# EAGLE design sx-signal84 (EAGLE 7.4.0)
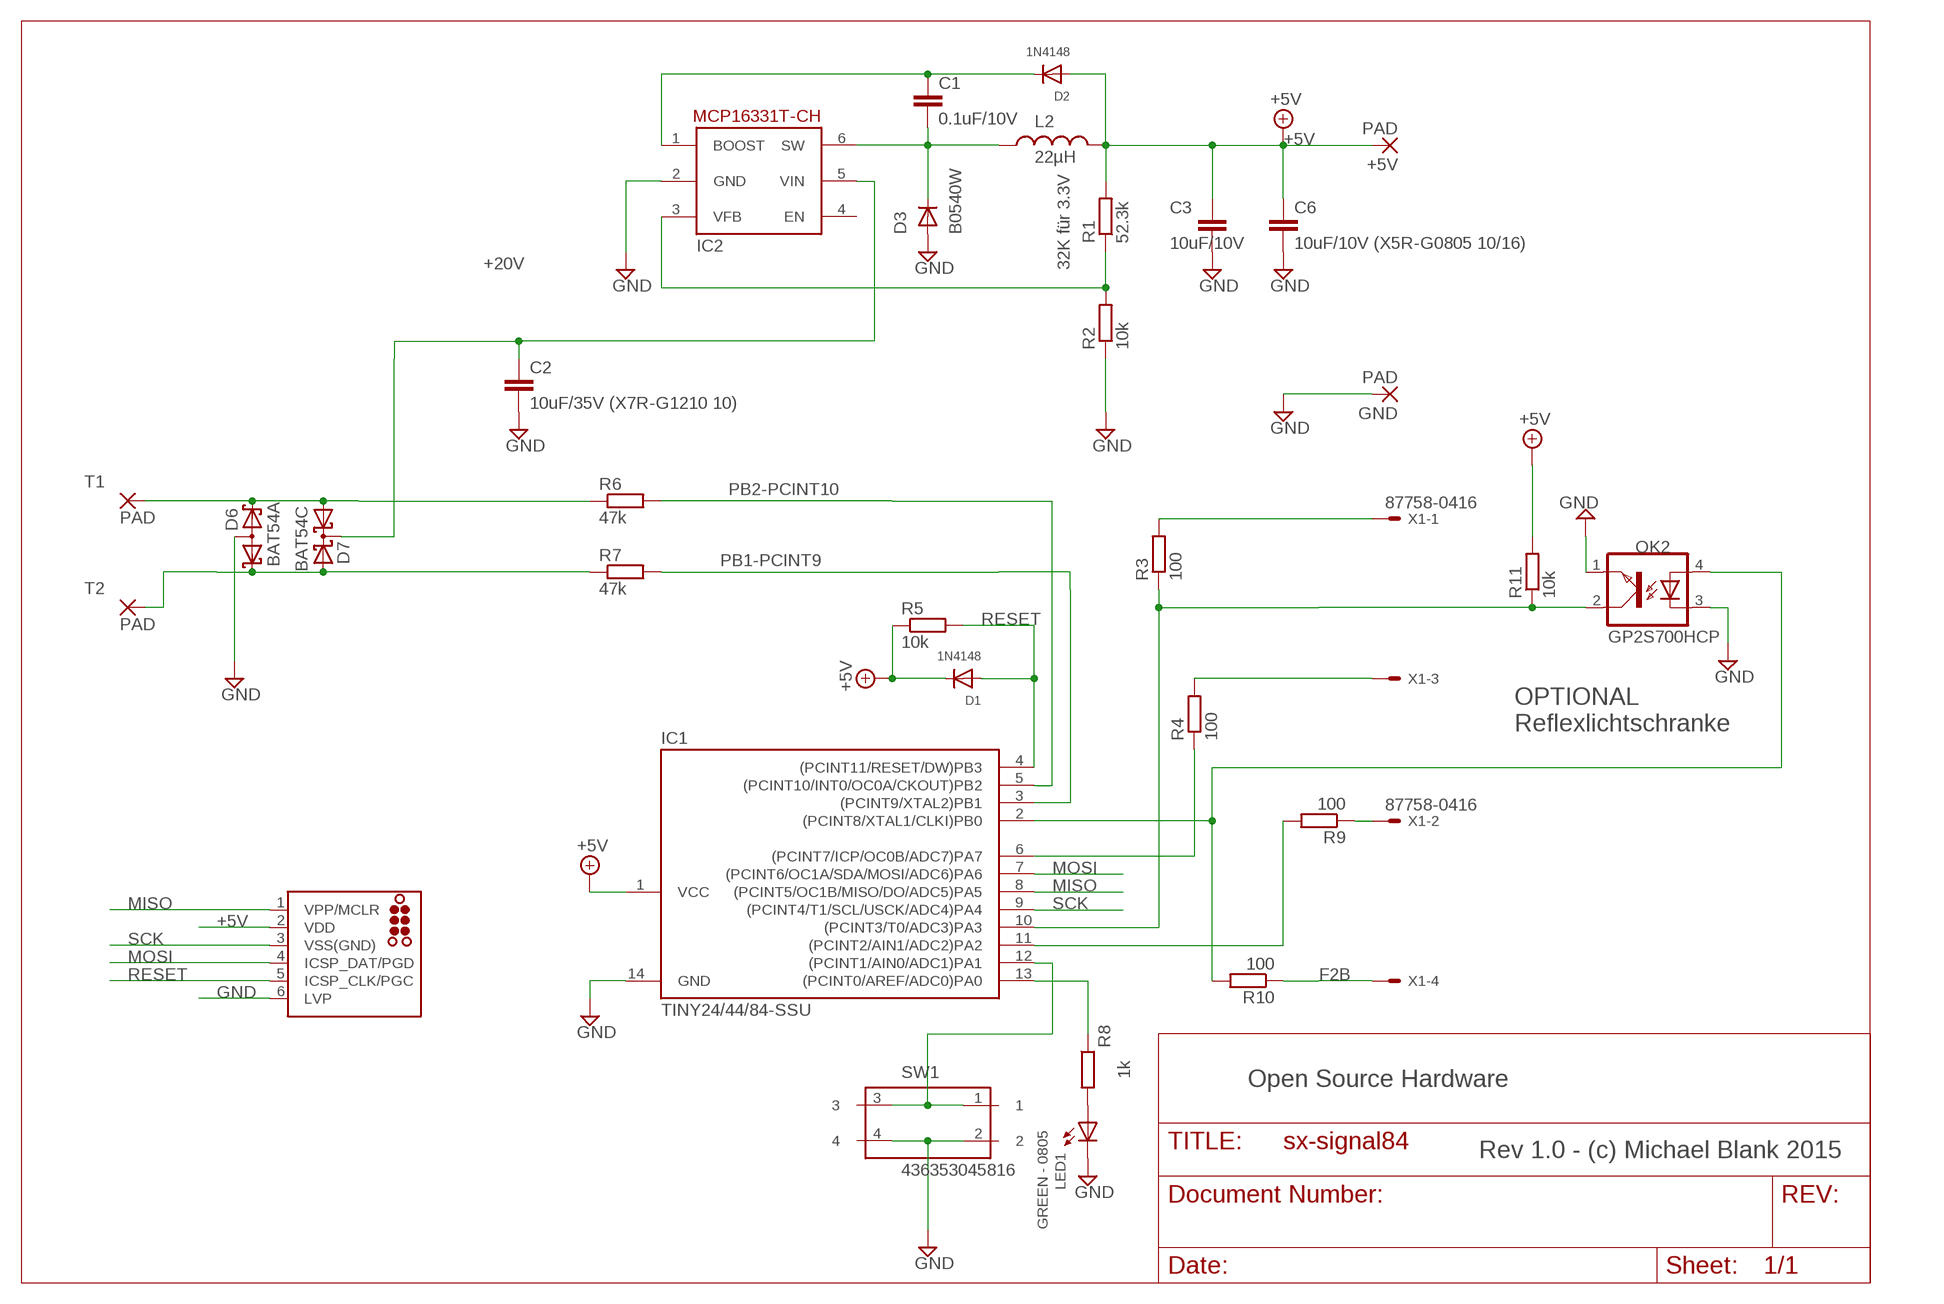
[diagram p0: schematic, sheet 1]

## Parts
+5V  PAD  SMD2  [SMD1,27-2,54]
C1  0.1uF/10V  C-EUC0805  [C0805]
C2  10uF/35V (X7R-G1210 10)  C-EUC1210  [C1210]
C3  10uF/10V  C-EUC0805  [C0805]
C6  10uF/10V (X5R-G0805 10/16)  C-EUC0805  [C0805]
D1  1N4148  DIODESOD-323F  [SOD-323F]
D2  1N4148  DIODESOD-323F  [SOD-323F]
D3  B0540W  DIODE-SOD123  [SOD123]
D6  BAT54A  [SOT23]
D7  BAT54C  [SOT23]
GND  PAD  SMD2  [SMD1,27-2,54]
IC1  TINY24/44/84-SSU  [SOIC14]
IC2  MCP16331  [SOT23-6]
J1  ISP  TC2030-MCP-NL  [TC2030-MCP-NL]
L2  22µH  INDUCTOR-SPARKFUN-B82462G  [B82462G]
LED1  GREEN - 0805  LED0805  [LED-0805]
OK2  GP2S700HCP  [SMD4-REFL]
R1  52.3k  R-EU_R0805W  [R0805W]
R2  10k  R-EU_R0805W  [R0805W]
R3  100  R-EU_R0805W  [R0805W]
R4  100  R-EU_R0805W  [R0805W]
R5  10k  R-EU_R0805W  [R0805W]
R6  47k  R-EU_R0805W  [R0805W]
R7  47k  R-EU_R0805W  [R0805W]
R8  1k  R-EU_R0805W  [R0805W]
R9  100  R-EU_R0805W  [R0805W]
R10  100  R-EU_R0805W  [R0805W]
R11  10k  R-EU_R0805W  [R0805W]
SW1  436353045816  [436353045816]
T1  PAD  SMD2  [SMD1,27-2,54]
T2  PAD  SMD2  [SMD1,27-2,54]
X1  87758-0416  [87758-0416]

## Nets
+5V: +5V.1(P) C3.1 C6.1 D1.C D2.A IC1.1(VCC) J1.2(VDD) L2.P$2 R1.2 R5.1 R11.2
+20V: C2.1 D7.3(CC) IC2.5(VIN)
F1A: IC1.10((PCINT3/T0/ADC3)PA3) OK2.2(COL) R3.1 R11.1
F1B: IC1.2((PCINT8/XTAL1/CLKI)PB0) OK2.4(A) R10.2
F2B: R10.1 X1.4
GND: C2.2 C3.2 C6.2 D3.A D6.3(AA) GND.1(P) IC1.14(GND) IC2.2(GND) J1.6(LVP) LED1.C OK2.1(EMIT) OK2.3(C) R2.1 SW1.2 SW1.4
MISO: IC1.8((PCINT5/OC1B/MISO/DO/ADC5)PA5) J1.1(VPP/MCLR)
MOSI: IC1.7((PCINT6/OC1A/SDA/MOSI/ADC6)PA6) J1.4(ICSP_DAT/PGD)
N$1: IC2.3(VFB) R1.1 R2.2
N$2: IC1.13((PCINT0/AREF/ADC0)PA0) R8.1
N$3: IC1.12((PCINT1/AIN0/ADC1)PA1) SW1.1 SW1.3
N$4: IC1.6((PCINT7/ICP/OC0B/ADC7)PA7) R4.1
N$6: R9.1 X1.2
N$7: C1.2 D3.C IC2.6(SW) L2.P$1
N$8: C1.1 D2.C IC2.1(BOOST)
N$9: LED1.A R8.2
N$10: IC1.11((PCINT2/AIN1/ADC2)PA2) R9.2
N$11: D6.2(K2) D7.1(A1) R6.1 T1.1(P)
N$14: R3.2 X1.1
N$15: R4.2 X1.3
PB1-PCINT9: IC1.3((PCINT9/XTAL2)PB1) R7.2
PB2-PCINT10: IC1.5((PCINT10/INT0/OC0A/CKOUT)PB2) R6.2
RESET: D1.A IC1.4((PCINT11/RESET/DW)PB3) J1.5(ICSP_CLK/PGC) R5.2
SCK: IC1.9((PCINT4/T1/SCL/USCK/ADC4)PA4) J1.3(VSS(GND))
TR-L1: D6.1(K1) D7.2(A2) R7.1 T2.1(P)
Unconnected: IC2.4(EN)

## Notes on the sheet
- 32K für 3.3V
- OPTIONAL
  Reflexlichtschranke
- Open Source Hardware
- Rev 1.0 - (c) Michael Blank 2015

## Library data of the parts
+5V GND T1 T2 = wirepad:SMD2: SMD PAD
C1-C3 C6 = rcl:C-EU: CAPACITOR, European symbol
D1 D2 = adafruit:DIODE: Diode SMADIODE - SMA Surface Mount Package 20V 1A Schottky Diode Digikey: 641-1014-6-ND DO-1N4148 - Through Hole Small Current Diode SOD-123 20V 1 A (.5mV Vf) Schottky Diode - Digikey: MBRX120TPMSCT-ND SOD-323 10V 570mA (.38mV Vf, 3ns) Schottky Diode - Digikey: ZLLS410CT-ND SOD-523 30V 30mA Schottky Diode (RB751S-40TE61) - Digikey: RB751S-40TE61CT-ND SOT23-R/W - SOT23 Package (R = Solder Paste/Reflow Ovens, W = Hand-Soldering) BAT54Film 40V 300mA - Digikey: 497-7162-1-ND
D3 = diode:DIODE-: DIODE
D6 = diode:BAT54A: Schottky Diodes Source: Fairchild .. BAT54.pdf
D7 = diode:BAT54C: Schottky Diodes Source: Fairchild .. BAT54.pdf
IC1 = avr-7:TINY24/44/84
IC2 = adafruit_MB:MCP16331: MCP73811 and MCP73812 Simple, Miniature Single-Cell, Fully Integrated Li-Ion / Li-Polymer Charge Management Controllers SOT-23-5 package, no indicator LED but with adjustable current, small and very inexpensive
J1 = tag-connect:TC2030: TAG-CONNECT ICSP Connector Manufacturer: Tag-Connect <http://www.tag-connect.com> Cable for easy In-Circuit Serial Programming. Designed for Microchip ICD2, suitable for many others. Two variants - one "with legs" (for hands-free fit on PCB) and another "without legs" for quick programming. PAD Description 1 MCLR/Vpp 2 Vdd 3 GND 4 PGD (ISPDAT) 5 PGC (ISPCLK) 6 nc (used for LVP) ©2009 ROFA.cz - modified and updated by Robert Darlington ‹rdarlington@gmail.com›
L2 = Spark:INDUCTOR-SPARKFUN: Inductors Basic Inductor/Choke - 0603 and 1206. Footprints are not proven and vary greatly between part numbers. SRN6045- 33uH, 20% 1.4A
LED1 = Ai_LED:LED
OK2 = optocoupler_MB:GP2S700HCP: Optocoupler, Phototransistor Output, Low Input Current Source: Data sheet <http://www.vishay.com/docs/83673/sfh618.pdf>
R1-R11 = rcl:R-EU_: RESISTOR, European symbol
SW1 = Switches_rev15f_MB:436353045816: WS-TUS-3.5x4.7 mm side push J-Bend SMD Tact Switch with boss design, 4 pins
X1 = con-molex:87758-0416: 4 Pin - 2mm Dual Row Single Wafer, Vertical T/H HDR Source: http://www.molex.com/pdm_docs/sd/877580616_sd.pdf; MF: FARNELL; MPN: 87758-0416; OC_FARNELL: 7472315; OC_NEWARK: 39K3681

## Board
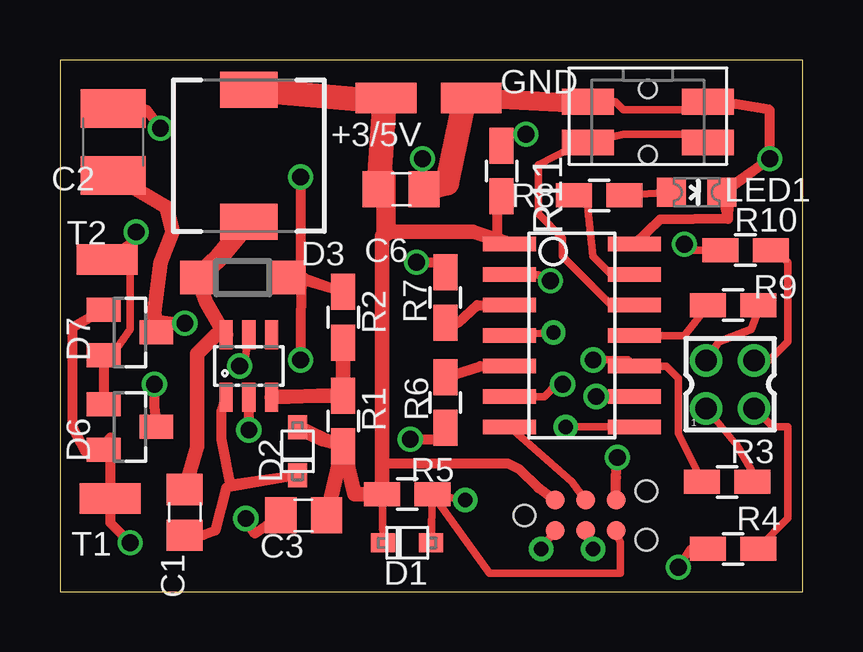
[diagram p1: board, top side]
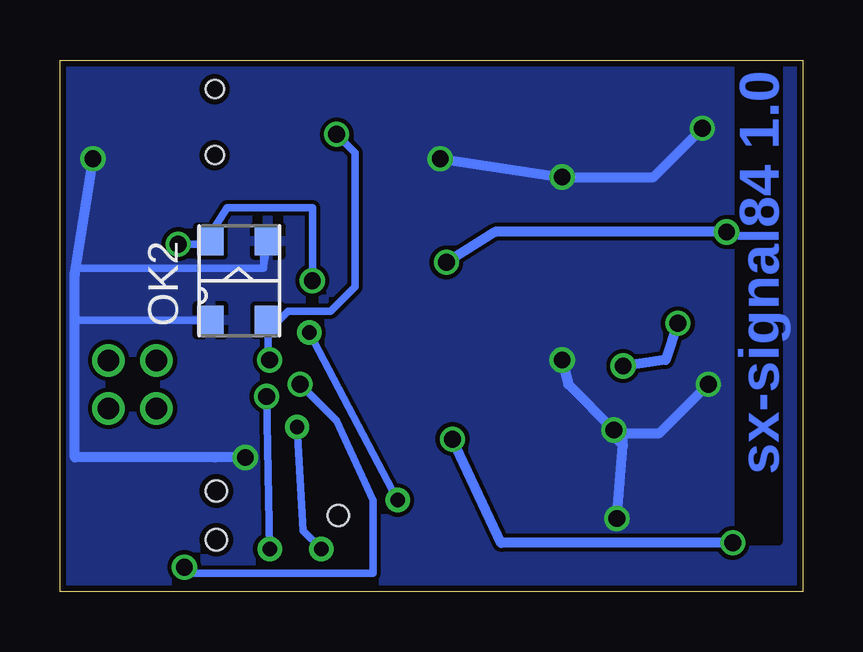
[diagram p2: board, bottom side, seen from below]

Size 30.97 x 22.15 mm. Coordinates in mm from the lower left corner, seen from the top.
Outline: 0,0 30.97,0 30.97,22.15 0,22.15 0,0
Copper layers (1*16): Top 0.035mm / dielectric 1.55mm / Bottom 0.035mm
Design rules "eC_2Layer_PClass6_BaseCopperO35": minimum track width 0.15mm, minimum drill 0.35mm, track to track 0.175mm, track to pad 0.175mm, pad to pad 0.175mm, via to via 0.175mm, smd to smd 0mil, copper to edge 0.25mm, drill to drill 0.35mm, minimum pad ring 0.175mm, minimum via ring 0.125mm, stop-mask expansion 0mil, vias tented up to drill 0.45mm, thermal gap 0.2mm

### Footprints (pad centres in the part's own frame; a part is rotated, then mirrored left to right if it is on the bottom)
SMD1,27-2,54 = smd 1.27 x 2.54: 1 0,0
C0805 = smd 1.3 x 1.5: 1 -0.95,0; 2 0.95,0
C1210 = smd 1.6 x 2.7: 1 -1.4,0; 2 1.4,0
SOD-323F = smd 1 x 0.8: A -1,0; C 1,0
SOD123 = smd 1.4 x 1.4: A 1.9,0; C -1.9,0
SOT23 = smd 1 x 1.4: 1 -0.95,-1.1; 2 0.95,-1.1; 3 0,1.1
SOIC14 = smd 0.61 x 2.21: 1 -3.81,-2.603; 2 -2.54,-2.603; 3 -1.27,-2.603; 4 0,-2.603; 5 1.27,-2.603; 6 2.54,-2.603; 7 3.81,-2.603; 8 3.81,2.603; 9 2.54,2.603; 10 1.27,2.603; 11 0,2.603; 12 -1.27,2.603; 13 -2.54,2.603; 14 -3.81,2.603
SOT23-6 = smd 0.55 x 1.2: 1 -0.95,-1.3; 2 0,-1.3; 3 0.95,-1.3; 4 0.95,1.3; 5 0,1.3; 6 -0.95,1.3
TC2030-MCP-NL = smd 0.787 x 0.787: 1 1.27,-0.635; 2 1.27,0.635; 3 2.54,-0.635; 4 2.54,0.635; 5 3.81,-0.635; 6 3.81,0.635 | hole 0.889: 0,0; 5.08,-1.016; 5.08,1.016
B82462G = smd 2.4 x 1.5: P$1 0,2.75; P$2 0,-2.75
LED-0805 = smd 1.2 x 1.2: A 0,-1.05; C 0,1.05
SMD4-REFL = smd 1.1 x 1.2: 1 -1.2,-1.65; 2 1.2,-1.65; 3 1.2,1.65; 4 -1.2,1.65
R0805W = smd 1.5 x 1: 1 -1.052,0; 2 1.052,0
436353045816 = smd 2.184 x 1.067: 1 2.5,0.85; 2 2.5,-0.85; 3 -2.5,0.85; 4 -2.5,-0.85 | hole 0.75: 0,-1.375; 0,1.375
87758-0416 = drill 0.9 pad 1.27: 1 -1,-1; 2 -1,1; 3 1,-1; 4 1,1

### Placement (x,y rotation side)
+5V  13.59,20.57 90 top
C1  5.21,3.3 90 top
C2  2.22,18.73 90 top
C3  10.16,3.17 180 top
C6  14.22,16.76 0 top
D1  14.48,2.03 180 top
D2  9.91,5.84 270 top
D3  7.62,13.08 0 top
D6  2.92,6.86 270 top
D7  2.92,10.79 270 top
GND  17.14,20.57 270 top
IC1  21.34,10.67 270 top
IC2  7.87,9.4 0 top
J1  19.37,3.17 0 top
L2  7.87,18.16 180 top
LED1  26.54,16.64 270 top
OK2  23.5,12.95 0 bottom
R1  11.81,7.11 270 top
R2  11.81,11.43 270 top
R3  27.81,4.57 0 top
R4  28.07,1.78 0 top
R5  14.48,4.06 0 top
R6  16.07,7.87 90 top
R7  16.07,12.26 270 top
R8  22.48,16.51 0 top
R9  28.07,11.94 180 top
R10  28.57,14.22 180 top
R11  18.41,17.53 270 top
SW1  24.51,19.56 180 top
T1  2.1,3.87 90 top
T2  1.97,13.84 90 top
X1  27.94,8.64 0 top

### Tracks (layer width: path | path; a pad name or v marks a point on that pad's centre or on a via)
+5V
  Top 0.305: R5.1 D1.C
  Top 0.406: J1.2 19.94,4.32 19.18,5.08 18.67,5.33 18.16,5.33 13.43,5.33 | R11.2 18.22,16.47 18.22,14.65
  Top 0.61: IC1.1 18.22,14.65 17.21,14.99 13.59,14.99 13.43,14.82 13.43,5.33 R5.1 12.28,4.06 R1.2 | R1.2 11.05,2.86 C3.1 | R1.2 11.85,6.06 11.81,6.1 10.94,6.35 D2.A
  Top 0.813: C6.1 13.59,17.27 13.59,15.24 13.59,14.99
  Top 1.016: L2.P$2 13.59,20.4 | 13.59,20.4 +5V.1 | 13.59,20.4 13.53,20.4 C6.1
+20V  (via drill 0.7)
  Top 0.305: v7.49,9.4 7.75,9.81 IC2.5
  Top 0.406: D7.3 4.02,11.35 v5.21,11.18
  Top 0.61: C2.1 4.44,16 4.7,14.99 4.19,13.72 3.94,11.64 D7.3
  Bottom 0.406: v5.21,11.18 5.71,9.65 v7.49,9.4
F1A  (via drill 0.7)
  Top 0.305: R3.1 26.51,5.12 25.78,6.6 25.78,8.89 25.27,9.4 IC1.10 23.69,9.65 v22.23,9.65 | v19.43,19.05 18.89,19.05 R11.1
  Bottom 0.305: v22.23,9.65 22.3,9.72 OK2.2 21.84,11.3 21.46,11.68 19.68,11.68 18.67,12.7 18.67,18.29 v19.43,19.05
F1B  (via drill 0.7)
  Top 0.305: R10.2 26.04,14.22 v26.04,14.48 | v20.45,12.95 20.19,12.95 19.94,13.21 IC1.2
  Bottom 0.305: v26.04,14.48 24.82,14.48 OK2.4 24.7,14.92 24,16 20.45,16 v20.45,12.95
F2B
  Top 0.305: X1.4 29.57,9.64 30.35,10.41 30.35,13.72 30.1,13.97 R10.1
GND  (via drill 0.7)
  Top 0.15: 22,20.42 SW1.2
  Top 0.305: SW1.2 23.15,20.41 23.5,20.07 26.04,20.07 | 26.04,20.07 26.67,20.07 SW1.4 | 26.04,20.07 27.31,20.31 28.07,20.32
  Top 0.406: 27.85,15.53 LED1.C 27.85,16.8 v29.59,18.03 | 27.85,15.53 25.02,15.49 IC1.14 | J1.6 23.18,4.76 v23.24,5.59 | v29.59,18.03 27.88,16.76 27.85,15.53 | v29.59,18.03 29.59,20.07 28.07,20.32 | C6.2 v15.11,18.03 | v4.19,19.3 3.62,20.07 C2.2 | v10.03,17.27 10.03,13.34 D3.A 10.2,13.08 R2.1 10.07,12.99 10.03,11.43 v10.03,9.65 | v3.94,8.64 3.94,7.7 D6.3 | C3.2 8.13,2.41 v7.75,3.05 | IC2.2 v7.87,6.73 | 22,20.32 22,20.42
  Top 0.813: GND.1 22,20.32
  Top 1.016: GND.1 16.89,20.57 16.13,17.02 C6.2
  Bottom 0.305: 22.48,14.62 22.48,13.97 | 22.48,13.97 22.48,13.59 | 22.48,13.59 22.48,13.46 29.59,13.46 30.35,13.46 v29.59,18.03 | OK2.1 30.35,11.3 30.35,11.43 | OK2.3 22.48,13.59 | 22.48,13.59 22.48,13.97
  Bottom 0.406: v23.24,5.59 24.51,5.59 30.35,5.59 30.35,11.43 30.35,13.21 v29.59,18.03 | v15.11,18.03 v10.03,17.27 6.22,17.27 v4.19,19.3 | v10.03,9.65 9.78,8.64 v7.87,6.73 | v7.87,6.73 7.75,6.6 7.49,6.6 | 7.49,6.6 5.97,6.6 v3.94,8.64 | v7.75,3.05 7.49,6.1 | 7.49,6.1 7.49,6.6 | v7.87,6.73 7.87,6.48 7.49,6.1
  pour Bottom: 0.13,21.97 0,0.13 30.99,0 30.99,21.97
MISO  (via drill 0.6 pad 1.02)
  Top 0.305: IC1.8 v21.08,6.86 | v20.07,1.78 J1.1
  Bottom 0.305: v21.08,6.86 20.83,2.54 v20.07,1.78
MOSI
  Top 0.305: IC1.7 21.34,4.57 J1.4
N$1
  Top 0.61: R2.2 R1.1 10.76,8.16 9.53,8.13 9.11,8.13 IC2.3
N$2
  Top 0.305: IC1.13 22.99,13.21 22.23,13.97 21.97,16.29 R8.1
N$3
  Top 0.305: IC1.12 22.99,11.94 21.72,13.21 20.96,13.97 20.96,14.73 19.94,15.75 19.94,17.78 21.92,18.8 SW1.1 23.5,19.05 26.29,19.05 SW1.3
N$4  (via drill 0.7)
  Top 0.305: R4.1 26.29,1.78 v25.78,1.02 | v20.96,8.64 20.7,8.64 20.19,8.13 IC1.6
  Bottom 0.305: v25.78,1.02 25.78,0.76 17.91,0.76 17.91,1.02 17.91,3.3 17.91,3.81 19.43,7.11 v20.96,8.64
N$6
  Top 0.305: R9.1 29.12,11.72 28.83,10.92 27.46,10.41 X1.2
N$7
  Top 0.61: D3.C 6.1,12.06 6.73,10.92 6.73,10.76 IC2.6 6.51,10.7 5.71,9.91 5.71,6.03 C1.2
  Top 0.813: L2.P$1 6.58,13.89 D3.C
N$8
  Top 0.406: IC2.1 6.73,7.53 6.73,6.6 6.73,6.35 7.11,4.45 D2.C 6.94,4.33 6.48,2.54 5.97,2.35 C1.1
N$9
  Top 0.305: R8.2 LED1.A
N$10
  Top 0.305: R9.2 27.01,11.9 26.04,10.67 25.27,10.67 IC1.11
N$11  (via drill 0.7)
  Top 0.406: D7.1 0.51,10.98 0.51,6.86 1.06,5.84 D6.2 2.1,6.42 T1.1 2.1,2.86 v2.92,2.03 | v14.61,6.35 16.28,6.35 R6.1
  Bottom 0.406: v2.92,2.03 12.57,2.03 v14.61,6.35
N$14
  Top 0.305: R3.2 28.83,4.57 28.83,5.08 28.23,6.1 X1.1
N$15
  Top 0.305: R4.2 29.12,1.81 30.35,3.05 30.35,6.86 29.72,6.86 X1.3
PB1-PCINT9
  Top 0.406: R7.2 16.61,11.2 17.4,11.94 IC1.3
PB2-PCINT10
  Top 0.406: R6.2 17.53,9.4 IC1.5
RESET  (via drill 0.6 pad 1.02)
  Top 0.305: R5.2 17.91,0.76 23.37,0.76 23.37,2.03 J1.5 | IC1.4 v20.57,10.79 | v16.89,3.81 R5.2 | R5.2 D1.A
  Bottom 0.305: v20.57,10.79 v16.89,3.81
SCK  (via drill 0.6 pad 1.02, 0.7 pad 1.02)
  Top 0.305: J1.3 v22.23,1.78
  Top 0.406: IC1.9 v22.35,8.13
  Bottom 0.305: v22.23,1.78 v22.35,8.13
TR-L1  (via drill 0.7)
  Top 0.305: D7.2 2.35,10.1 2.92,10.92 2.92,13.4 T2.1
  Top 0.406: D7.2 D6.1 | T2.1 2.98,14.54 v3.18,14.99 | v14.86,13.72 16.22,13.72 R7.1
  Bottom 0.406: v3.18,14.99 12.83,14.99 v14.86,13.72

### Text on the board
Bottom: sx-signal84 1.0
tNames: +3/5V